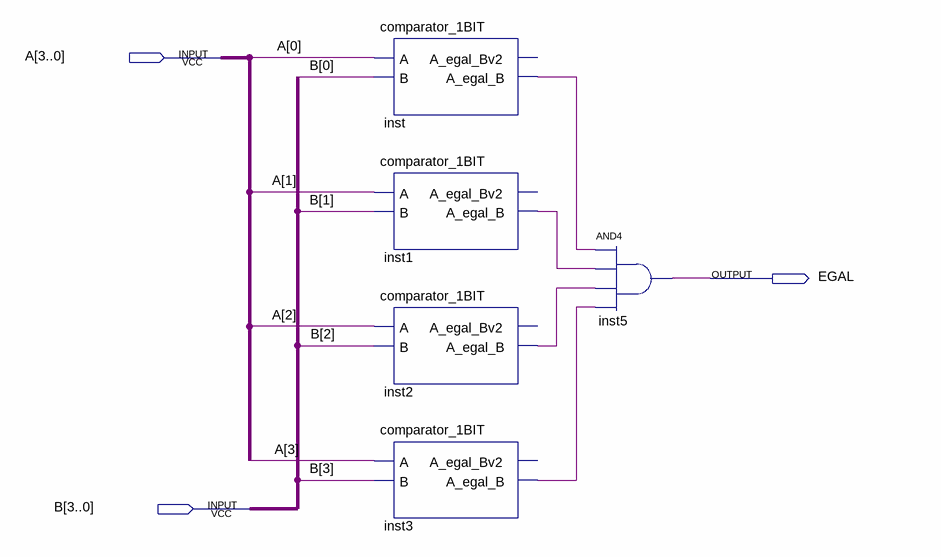
[diagram p0: schematic sheet]
// Quartus schematic comparator_4BIT.bdf as structural Verilog: 5 symbols, 3 pins
module comparator_4BIT (
  input  [3:0] A,
  input  [3:0] B,
  output EGAL
);

  wire inst1_a_egal_b, inst2_a_egal_b, inst3_a_egal_b, inst_a_egal_b;

  comparator_1BIT inst (.A(A[0]), .B(B[0]), .A_egal_B(inst_a_egal_b));  // open: A_egal_Bv2
  comparator_1BIT inst1 (.A(A[1]), .B(B[1]), .A_egal_B(inst1_a_egal_b));  // open: A_egal_Bv2
  comparator_1BIT inst2 (.A(A[2]), .B(B[2]), .A_egal_B(inst2_a_egal_b));  // open: A_egal_Bv2
  comparator_1BIT inst3 (.A(A[3]), .B(B[3]), .A_egal_B(inst3_a_egal_b));  // open: A_egal_Bv2
  and inst5 (EGAL, inst_a_egal_b, inst1_a_egal_b, inst2_a_egal_b, inst3_a_egal_b);
endmodule
